# EAGLE design nRF52832_MCU (EAGLE 7.6.0)

## Sheet 1 of 2
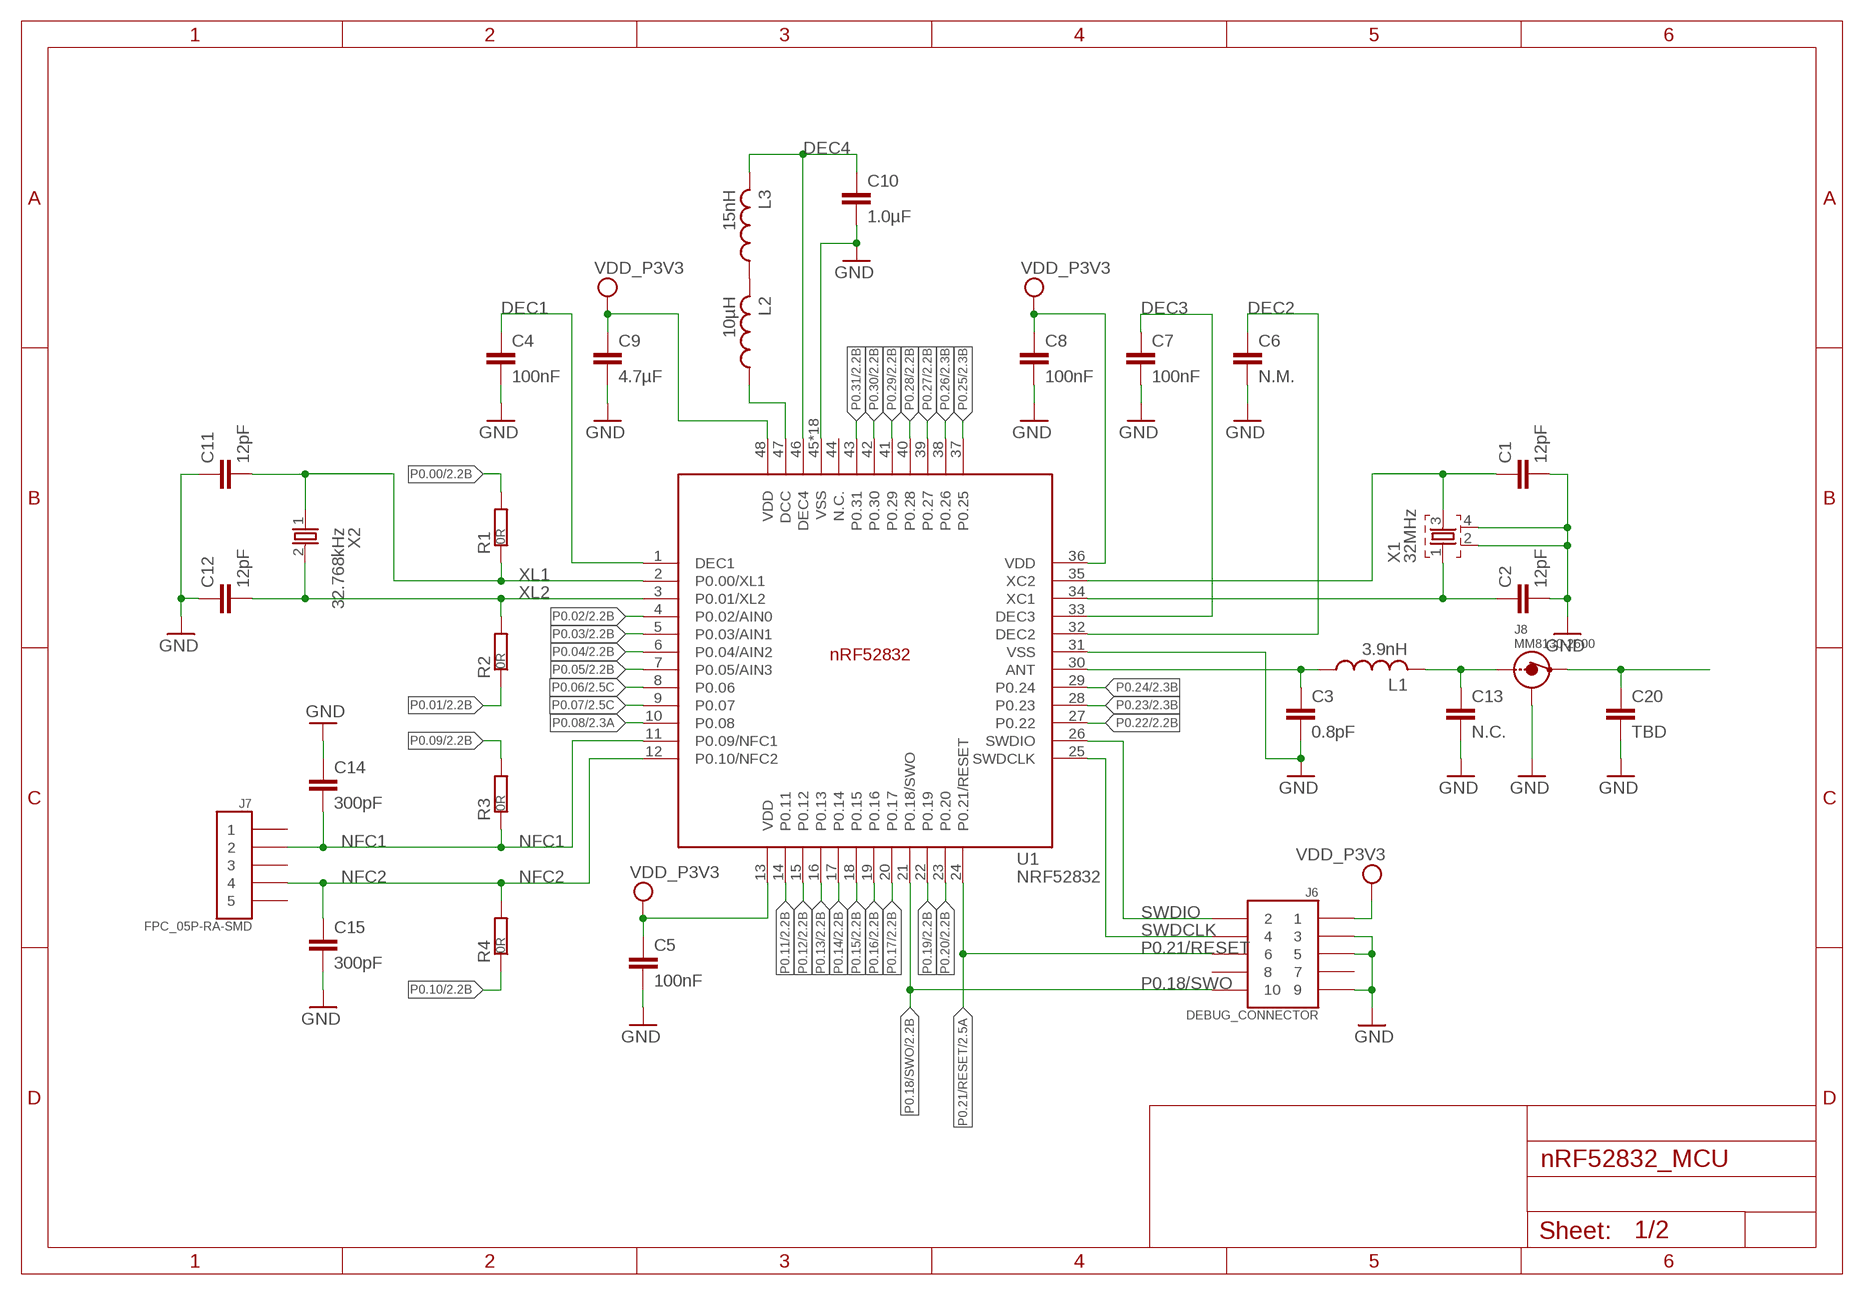
[diagram p0: schematic, sheet 1]

### Parts
C1  12pF  CAPACITOR_0402_N  [RESC0402_N]
C2  12pF  CAPACITOR_0402_N  [RESC0402_N]
C3  0.8pF  CAPACITOR_0402_N  [RESC0402_N]
C4  100nF  CAPACITOR_0402_N  [RESC0402_N]
C5  100nF  CAPACITOR_0402_N  [RESC0402_N]
C6  N.M.  CAPACITOR_0402_N  [RESC0402_N]
C7  100nF  CAPACITOR_0402_N  [RESC0402_N]
C8  100nF  CAPACITOR_0402_N  [RESC0402_N]
C9  4.7µF  CAPACITOR_0603_N  [RESC0603_N]
C10  1.0µF  CAPACITOR_0603_N  [RESC0603_N]
C11  12pF  CAPACITOR_0402_N  [RESC0402_N]
C12  12pF  CAPACITOR_0402_N  [RESC0402_N]
C13  N.C.  CAPACITOR_0402_N  [RESC0402_N]
C14  300pF  CAPACITOR_0402_N  [RESC0402_N]
C15  300pF  CAPACITOR_0402_N  [RESC0402_N]
C20  TBD  CAPACITOR_0402_N  [RESC0402_N]
J6  DEBUG_CONNECTOR  [HDRV127P5X2-10_N]
J7  FPC_05P-RA-SMD  [FPC_05P-RA-SMD]
J8  MM8130-2600  [MM8130-2600]
L1  3.9nH  INDUCTOR_0402_N  [RESC0402_N]
L2  10µH  INDUCTOR_0603_N  [RESC0603_N]
L3  15nH  INDUCTOR_0402_N  [RESC0402_N]
R1  0R  RESISTOR_0402_N  [RESC0402_N]
R2  0R  RESISTOR_0402_N  [RESC0402_N]
R3  0R  RESISTOR_0402_N  [RESC0402_N]
R4  0R  RESISTOR_0402_N  [RESC0402_N]
U1  NRF52832  [QFN40P600X600X90-48_N]
X1  32MHz  XTAL_32MHZ  [BT-XTAL_2016_N]
X2  32.768kHz  XTAL_32KHZ  [XTAL_3215_N]

### Nets
ANT: C3.1 L1.1 U1.30(ANT)
DEC1: C4.1 U1.1(DEC1)
DEC2: C6.1 U1.32(DEC2)
DEC3: C7.1 U1.33(DEC3)
DEC4: C10.1 L3.2 U1.46(DEC4)
GND: C1.2 C2.2 C3.2 C4.2 C5.2 C6.2 C7.2 C8.2 C9.2 C10.2 C11.1 C12.1 C13.2 C14.1 C15.2 C20.2 J6.3 J6.5 J6.9 J8.1 J8.2 J8.3 J8.4 U1.31(VSS) U1.45(VSS) U1.PAD(VSS) U1.PAD@VIA01(VSS) U1.PAD@VIA02(VSS) U1.PAD@VIA03(VSS) U1.PAD@VIA04(VSS) U1.PAD@VIA05(VSS) U1.PAD@VIA06(VSS) U1.PAD@VIA07(VSS) U1.PAD@VIA08(VSS) U1.PAD@VIA09(VSS) U1.PAD@VIA10(VSS) U1.PAD@VIA11(VSS) U1.PAD@VIA12(VSS) U1.PAD@VIA13(VSS) U1.PAD@VIA14(VSS) U1.PAD@VIA15(VSS) U1.PAD@VIA16(VSS) X1.2 X1.4 ; also sheet 2
N$1: C20.1 J8.OUT
N$2: L2.2 L3.1
N$3: C1.1 U1.35(XC2) X1.3
N$4: L2.1 U1.47(DCC)
N$5: C13.1 J8.IN L1.2
NFC1: C14.2 J7.2 R3.1 U1.11(P0.09/NFC1)
NFC2: C15.1 J7.4 R4.2 U1.12(P0.10/NFC2)
P0.00: R1.2 ; also sheet 2
P0.01: R2.1 ; also sheet 2
P0.02: U1.4(P0.02/AIN0) ; also sheet 2
P0.03: U1.5(P0.03/AIN1) ; also sheet 2
P0.04: U1.6(P0.04/AIN2) ; also sheet 2
P0.05: U1.7(P0.05/AIN3) ; also sheet 2
P0.06: U1.8(P0.06) ; also sheet 2
P0.07: U1.9(P0.07) ; also sheet 2
P0.08: U1.10(P0.08) ; also sheet 2
P0.09: R3.2 ; also sheet 2
P0.10: R4.1 ; also sheet 2
P0.11: U1.14(P0.11) ; also sheet 2
P0.12: U1.15(P0.12) ; also sheet 2
P0.13: U1.16(P0.13) ; also sheet 2
P0.14: U1.17(P0.14) ; also sheet 2
P0.15: U1.18(P0.15) ; also sheet 2
P0.16: U1.19(P0.16) ; also sheet 2
P0.17: U1.20(P0.17) ; also sheet 2
P0.18/SWO: J6.10 U1.21(P0.18/SWO) ; also sheet 2
P0.19: U1.22(P0.19) ; also sheet 2
P0.20: U1.23(P0.20) ; also sheet 2
P0.21/RESET: J6.6 U1.24(P0.21/RESET) ; also sheet 2
P0.22: U1.27(P0.22) ; also sheet 2
P0.23: U1.28(P0.23) ; also sheet 2
P0.24: U1.29(P0.24) ; also sheet 2
P0.25: U1.37(P0.25) ; also sheet 2
P0.26: U1.38(P0.26) ; also sheet 2
P0.27: U1.39(P0.27) ; also sheet 2
P0.28: U1.40(P0.28) ; also sheet 2
P0.29: U1.41(P0.29) ; also sheet 2
P0.30: U1.42(P0.30) ; also sheet 2
P0.31: U1.43(P0.31) ; also sheet 2
SWDCLK: J6.4 U1.25(SWDCLK)
SWDIO: J6.2 U1.26(SWDIO)
VDD_P3V3: C5.1 C8.1 C9.1 J6.1 U1.13(VDD) U1.36(VDD) U1.48(VDD) ; also sheet 2
X1: C2.1 U1.34(XC1) X1.1
XL1: C11.2 R1.1 U1.2(P0.00/XL1) X2.1
XL2: C12.2 R2.2 U1.3(P0.01/XL2) X2.2
Unconnected: J6.7 J6.8 J7.1 J7.3 J7.5 U1.44(N.C.)

## Sheet 2 of 2
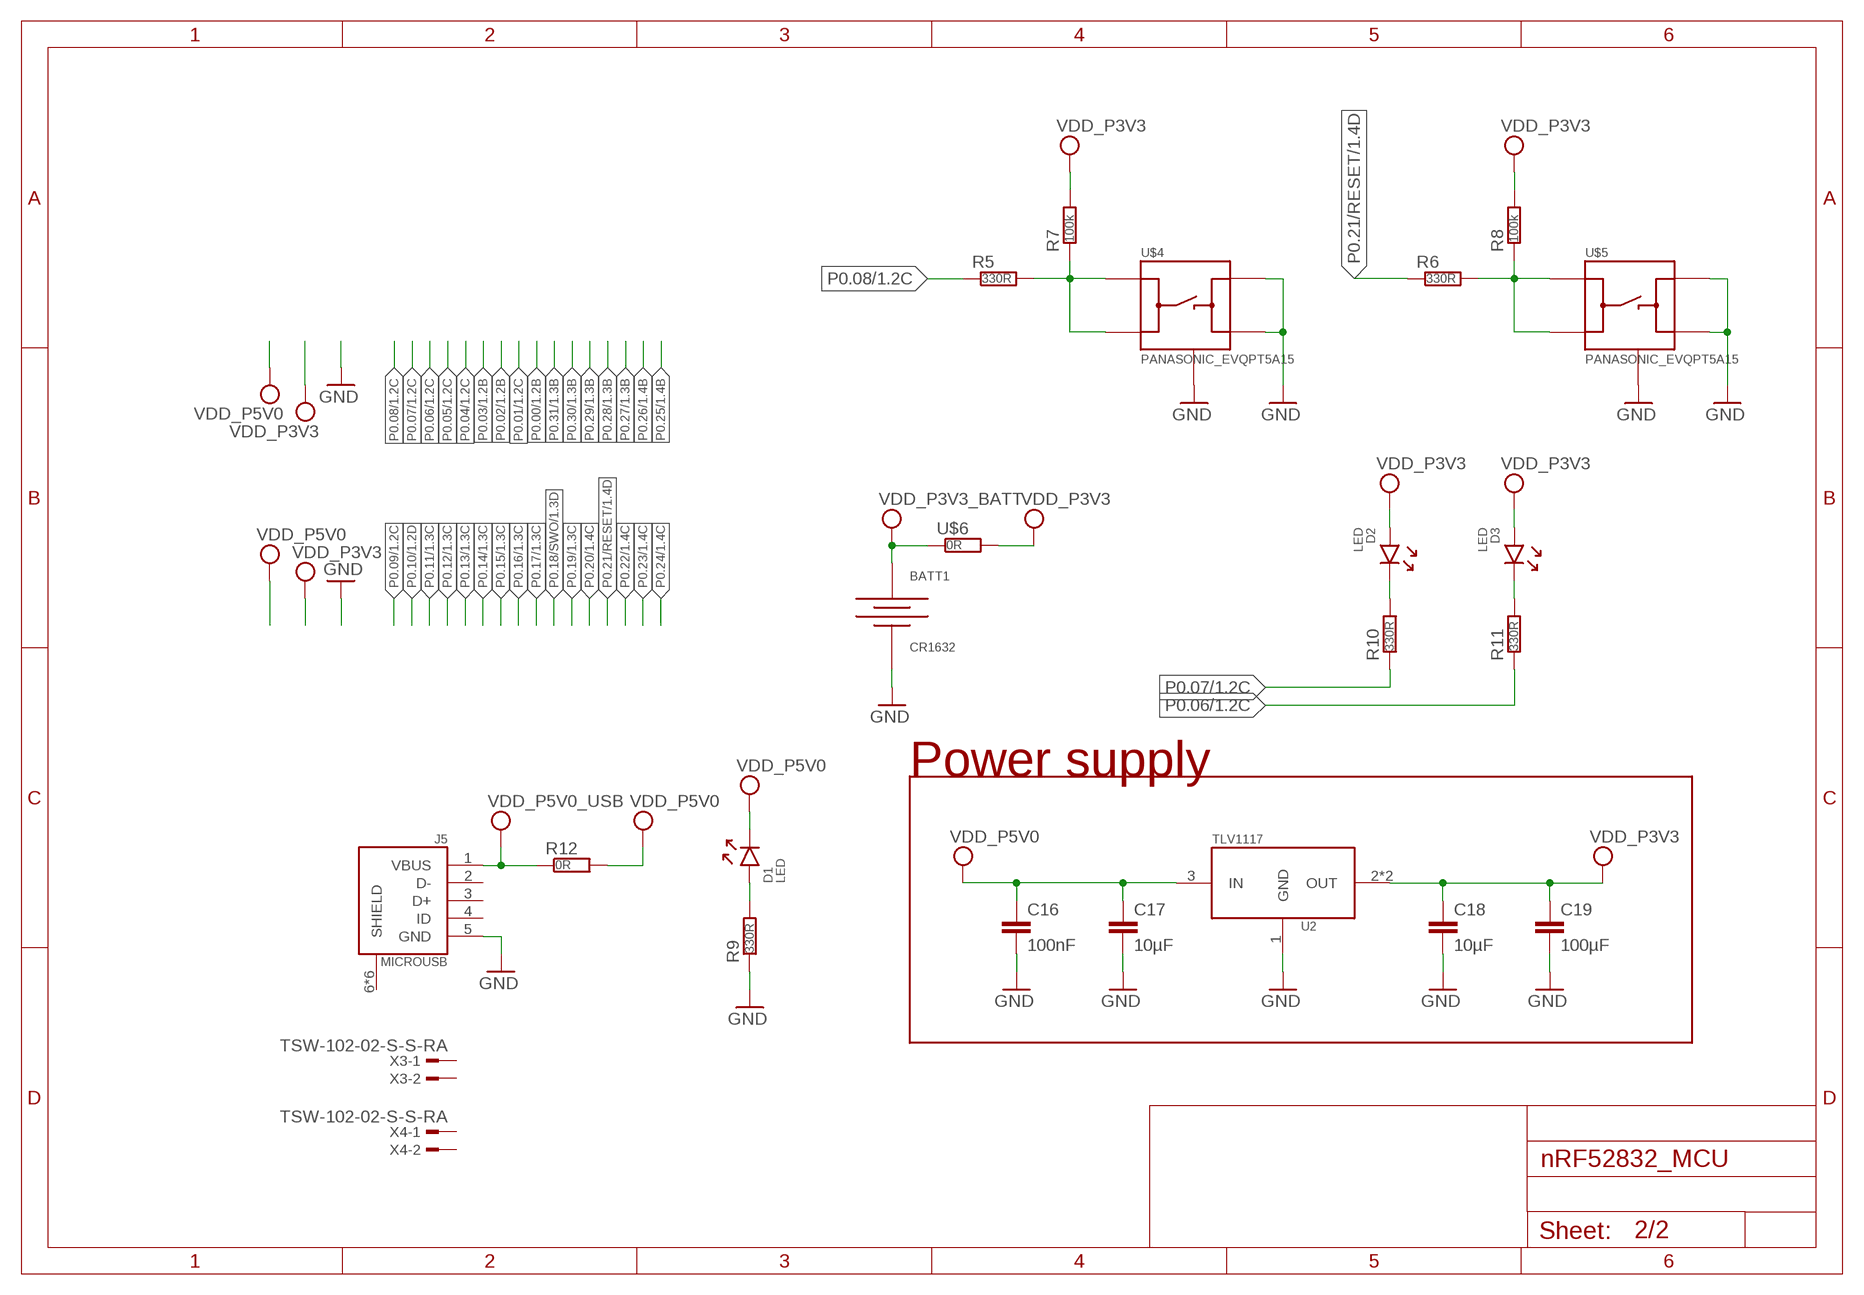
[diagram p1: schematic, sheet 2]

### Parts
BATT1  CR1632  [CR1632_HOLDER_TH]
C16  100nF  CAPACITOR_0402_N  [RESC0402_N]
C17  10µF  CAPACITOR_0603_N  [RESC0603_N]
C18  10µF  CAPACITOR_0603_N  [RESC0603_N]
C19  100µF  CAPACITOR_0805_N  [RESC0805_N]
D1  LED  [DIOC0603_N]
D2  LED  [DIOC0603_N]
D3  LED  [DIOC0603_N]
J5  MICROUSB  [USB-MICRO-B-RA-SMD-PIP]
R5  330R  RESISTOR_0402_N  [RESC0402_N]
R6  330R  RESISTOR_0402_N  [RESC0402_N]
R7  100k  RESISTOR_0402_N  [RESC0402_N]
R8  100k  RESISTOR_0402_N  [RESC0402_N]
R9  330R  RESISTOR_0402_N  [RESC0402_N]
R10  330R  RESISTOR_0402_N  [RESC0402_N]
R11  330R  RESISTOR_0402_N  [RESC0402_N]
R12  0R  RESISTOR_0402_N  [RESC0402_N]
U2  TLV1117  [SOT220P700-4_N]
U$4  PANASONIC_EVQPT5A15  [PANASONIC_EVQPT5A15]
U$5  PANASONIC_EVQPT5A15  [PANASONIC_EVQPT5A15]
U$6  0R  RESISTOR_0402_N  [RESC0402_N]
X3  TSW-102-02-S-S-RA  [TSW-102-02-S-S-RA]
X4  TSW-102-02-S-S-RA  [TSW-102-02-S-S-RA]

### Nets
GND: BATT1.1(-) C16.2 C17.2 C18.2 C19.2 J5.5(GND) R9.1 U2.1(GND) U$4.3(B) U$4.4(B') U$4.5(GND) U$4.6(GND) U$5.3(B) U$5.4(B') U$5.5(GND) U$5.6(GND) ; also sheet 1
N$6: R6.2 R8.1 U$5.1(A) U$5.2(A')
N$7: R5.2 R7.1 U$4.1(A) U$4.2(A')
N$8: D2.1(C) R10.2
N$9: D3.1(C) R11.2
P0.06: R11.1 ; also sheet 1
P0.07: R10.1 ; also sheet 1
P0.08: R5.1 ; also sheet 1
P0.21/RESET: R6.1 ; also sheet 1
VCC_P5V0_USB: J5.1(VBUS) R12.1 ; supply symbol labelled VDD_P5V0_USB
VDD_LED: D1.2(A) R9.2
VDD_P3V3: C18.1 C19.1 D2.2(A) D3.2(A) R7.2 R8.2 U2.2(OUT) U2.4(OUT) U$6.2 ; also sheet 1
VDD_P3V3_BATT: BATT1.2(+) BATT1.3(+) U$6.1
VDD_P5V0: C16.1 C17.1 D1.1(C) R12.2 U2.3(IN)
Unconnected: J5.2(D-) J5.3(D+) J5.4(ID) J5.6(SHIELD) J5.7(SHIELD) J5.8(SHIELD) J5.9(SHIELD) J5.10(SHIELD) J5.11(SHIELD) X3.1 X3.2 X4.1 X4.2

### Notes on the sheet
- Power supply

## Library data of the parts
BATT1 = Nordic_misc:CR1632: KEYSTONE 3013 BATTERY THM RETAINER, 16MM Farnell: 1650698
C1-C20 = Nordic_misc:CAPACITOR: Generic chip capacitor
D1-D3 = Nordic_misc:LED
J5 = Nordic_misc:MICROUSB
J6 = Nordic_misc:DEBUG_CONNECTOR
J7 = Nordic_misc:FPC_05P-RA-SMD
J8 = Nordic_misc:MM8130-2600
L1-L3 = Nordic_misc:INDUCTOR: Generic chip inductor
R1-R12 U$6 = Nordic_misc:RESISTOR: Generic chip resistor
U1 = Nordic_nRF:NRF52832: nRF52832 Features Single chip, highly flexible, 2.4 GHz multi-protocol SoC 32-bit ARM Cortex-M4F Processor 1.7v to 3.6v operation 512kB flash + 64kB RAM Supports concurrent Bluetooth Smart/ANT protocol operation On-chip NFC tag for Out-of-Band (OOB) pairing Up to +4dBm output power -96dBm sensitivity, Bluetooth Smart Thread safe and run-time protected Event driven API On air compatible with nRF24L and nRF24AP series 2 data rates (2Mbps/1Mbps) PPI - maximum flexibility for power-efficient applications and code simplification Automated power management system with automatic power management of each peripheral Configurable I/O mapping for analog and digital I/O 3 x Master/Slave SPI 2 x Two-wire interface (I²C) UART (RTS/CTS) 3 x PWM AES HW encryption Real Time Counter (RTC) Digital microphone interface (PDM) On-chip balun Applications Internet of Things (IoT) Wearables SmartHome sensors Connected white goods Computer peripherals Voice-command smart remotes A4WP ‘Rezence’ wireless charging Beacons Sports and fitness sensors and hubs Connected health products Smart watches RC Toys Interactive games Building automation and sensor networks
U2 = Nordic_misc:TLV1117
U$4 U$5 = Nordic_misc:PANASONIC_EVQPT5A15
X1 = Nordic_nRF:XTAL_32MHZ
X2 = Nordic_nRF:XTAL_32KHZ
X3 X4 = con-samtec:TSW-102-02-S-S: THROUGH-HOLE .025" SQ POST HEADER Source: Samtec TSW.pdf; OC_FARNELL: unknown; OC_NEWARK: unknown

## Board
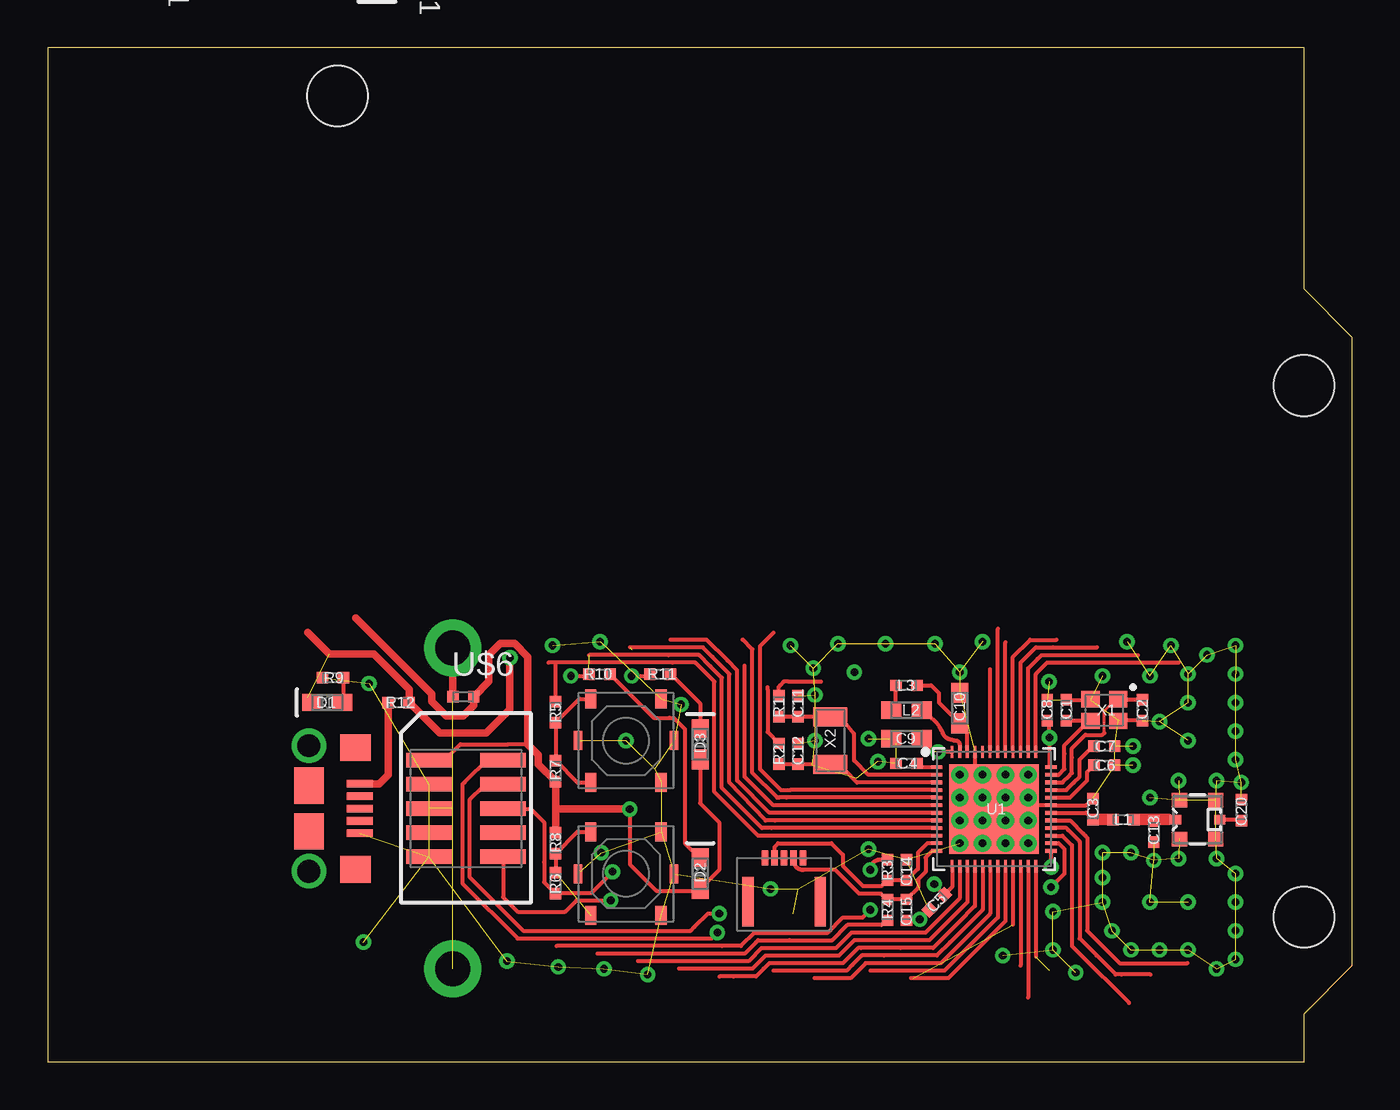
[diagram p2: board, top side]
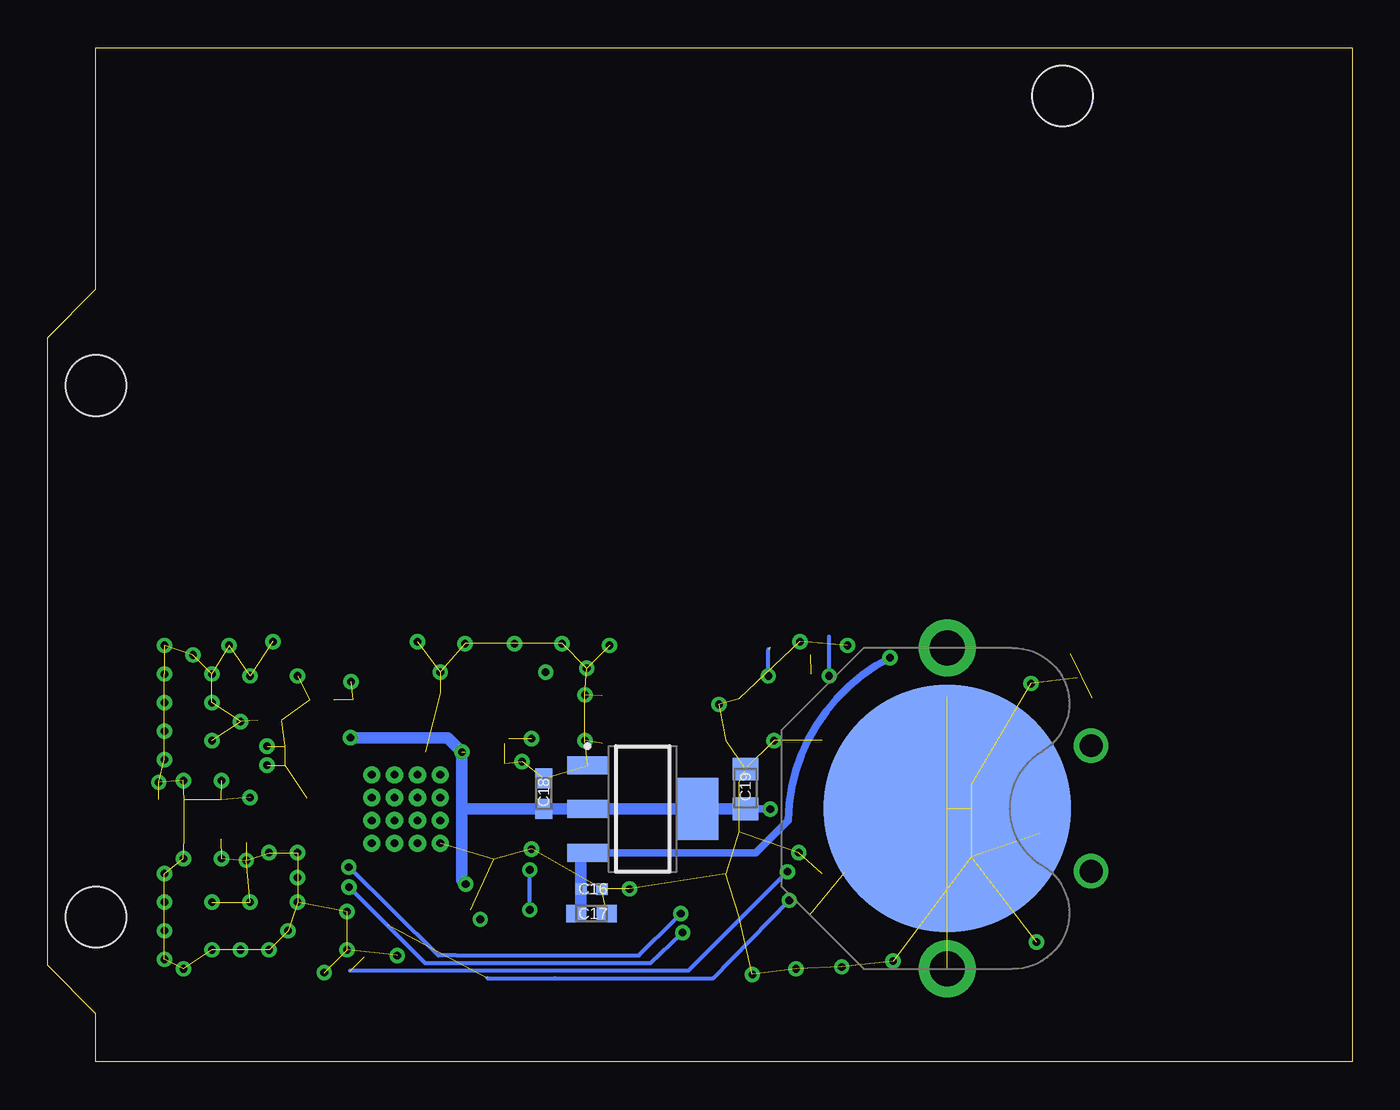
[diagram p3: board, bottom side, seen from below]

Size 68.58 x 53.34 mm. Coordinates in mm from the lower left corner, seen from the top.
Outline: 0,0 66.04,0 66.04,2.54 68.58,5.08 68.58,38.1 66.04,40.64 66.04,53.34 0,53.34 0,0
Copper layers (1*16): Top 0.035mm / dielectric 1.5mm / Bottom 0.035mm
Design rules "Nordic": minimum track width 0.15mm, minimum drill 0.4mm, track to track 0.15mm, track to pad 0.15mm, pad to pad 0.15mm, via to via 0.15mm, smd to smd 0.15mm, copper to edge 0.4mm, drill to drill 0.4mm, minimum pad ring 10mil, minimum via ring 8mil, stop-mask expansion 4mil, vias tented up to drill 0mil, thermal gap 0.2mm
Holes 3.2 mm at 66.04,7.62 66.04,35.56 15.24,50.8
tRestrict: area 53.1,11.5 to 56.7,15.3

### Footprints (pad centres in the part's own frame; a part is rotated, then mirrored left to right if it is on the bottom)
CR1632_HOLDER_TH = smd 13 x 13: 1 0,0 | drill 1.85 pad 3: 2 -8.435,0; 3 8.435,0
RESC0402_N = smd 0.6 x 0.6: 1 -0.55,0; 2 0.55,0
RESC0603_N = smd 1.05 x 0.9: 1 -0.8,0; 2 0.8,0
RESC0805_N = smd 1.2 x 1.35: 1 -1.1,0; 2 1,0
DIOC0603_N = smd 1.05 x 0.9: 1 -0.8,0; 2 0.8,0
USB-MICRO-B-RA-SMD-PIP = smd 1.35 x 0.4: 1 0,1.3; 2 0,0.65; 3 0,0; 4 0,-0.65; 5 0,-1.3 | smd 1.6 x 1.4: 6 -0.225,3.2; 7 -0.225,-3.2 | smd 1.55 x 1.9: 8 -2.675,1.2; 9 -2.675,-1.2 | drill 1.2: 10 -2.675,3.3; 11 -2.675,-3.3
HDRV127P5X2-10_N = smd 0.76 x 2.4: 1 -2.54,-1.95; 2 -2.54,1.95; 3 -1.27,-1.95; 4 -1.27,1.95; 5 0,-1.95; 6 0,1.95; 7 1.27,-1.95; 8 1.27,1.95; 9 2.54,-1.95; 10 2.54,1.95
FPC_05P-RA-SMD = smd 0.6 x 2.6: 0 -1.9,-0.7; 00 1.9,-0.7 | smd 0.35 x 0.8: 1 -1,1.6; 2 -0.5,1.6; 3 0,1.6; 4 0.5,1.6; 5 1,1.6
MM8130-2600 = smd 0.75 x 0.8: 1 -1.025,0.95; 2 1.025,0.95; 3 -1.025,-0.95; 4 1.025,-0.95 | smd 0.5 x 0.58: IN 0,1.16; OUT 0,-1.16
QFN40P600X600X90-48_N = smd 0.65 x 0.2: 1 -3,2.2; 2 -3,1.8; 3 -3,1.4; 4 -3,1; 5 -3,0.6; 6 -3,0.2; 7 -3,-0.2; 8 -3,-0.6; 9 -3,-1; 10 -3,-1.4; 11 -3,-1.8; 12 -3,-2.2; 25 3,-2.2; 26 3,-1.8; 27 3,-1.4; 28 3,-1; 29 3,-0.6; 30 3,-0.2; 31 3,0.2; 32 3,0.6; 33 3,1; 34 3,1.4; 35 3,1.8; 36 3,2.2 | smd 0.2 x 0.65: 13 -2.2,-3; 14 -1.8,-3; 15 -1.4,-3; 16 -1,-3; 17 -0.6,-3; 18 -0.2,-3; 19 0.2,-3; 20 0.6,-3; 21 1,-3; 22 1.4,-3; 23 1.8,-3; 24 2.2,-3; 37 2.2,3; 38 1.8,3; 39 1.4,3; 40 1,3; 41 0.6,3; 42 0.2,3; 43 -0.2,3; 44 -0.6,3; 45 -1,3; 46 -1.4,3; 47 -1.8,3; 48 -2.2,3 | smd 4.7 x 4.7: PAD 0,0 | drill 0.4: PAD@VIA01 -1.8,1.8; PAD@VIA02 -1.8,0.6; PAD@VIA03 -1.8,-0.6; PAD@VIA04 -1.8,-1.8; PAD@VIA05 -0.6,1.8; PAD@VIA06 -0.6,0.6; PAD@VIA07 -0.6,-0.6; PAD@VIA08 -0.6,-1.8; PAD@VIA09 0.6,1.8; PAD@VIA10 0.6,0.6; PAD@VIA11 0.6,-0.6; PAD@VIA12 0.6,-1.8; PAD@VIA13 1.8,1.8; PAD@VIA14 1.8,0.6; PAD@VIA15 1.8,-0.6; PAD@VIA16 1.8,-1.8
SOT220P700-4_N = smd 2.15 x 0.95: 1 -2.9,2.3; 2 -2.9,0; 3 -2.9,-2.3 | smd 2.15 x 3.25: 4 2.9,0
PANASONIC_EVQPT5A15 = smd 0.6 x 1: 1 -1.85,2.2; 2 -1.85,-2.2; 3 1.85,2.2; 4 1.85,-2.2 | smd 0.45 x 1: 5 -2.525,0; 6 2.525,0
BT-XTAL_2016_N = smd 0.95 x 0.85: 1 -0.725,-0.575; 2 0.725,-0.575; 3 0.725,0.575; 4 -0.725,0.575
XTAL_3215_N = smd 1 x 1.8: 1 -1.25,0; 2 1.25,0
TSW-102-02-S-S-RA = drill 1 pad 1.5 octagon: 1 1.27,1.524; 2 -1.27,1.524

### Placement (x,y rotation side)
BATT1  21.29,13.33 270 bottom
C1  53.54,18.5 90 top
C2  57.54,18.5 270 top
C3  54.94,13.3 90 top
C4  45.14,15.7 180 top
C5  46.74,8.4 225 top
C6  55.54,15.6 0 top
C7  55.54,16.6 0 top
C8  52.54,18.5 90 top
C9  45.14,17 180 top
C10  47.94,18.6 90 top
C11  39.44,18.7 270 top
C12  39.44,16.2 270 top
C13  58.14,12.1 270 top
C14  45.14,10.1 270 top
C15  45.14,8 270 top
C16  40,9.1 0 bottom
C17  40,7.8 0 bottom
C18  42.5,14.1 90 bottom
C19  31.9,14.4 90 bottom
C20  62.74,13.25 90 top
D1  14.7,18.9 0 top
D2  34.3,9.9 270 top
D3  34.3,16.7 270 top
J5  16.41,13.33 0 top
J6  21.99,13.33 270 top
J7  38.71,9.14 0 top
J8  60.44,12.75 90 top
L1  56.54,12.75 0 top
L2  45.14,18.5 180 top
L3  45.14,19.8 0 top
R1  38.44,18.7 90 top
R2  38.44,16.2 270 top
R3  44.14,10.1 90 top
R4  44.14,8 90 top
R5  26.7,18.4 270 top
R6  26.7,9.4 90 top
R7  26.7,15.3 270 top
R8  26.7,11.5 90 top
R9  15,20.2 0 top
R10  29,20.4 0 top
R11  32.2,20.4 0 top
R12  18.45,18.9 0 top
U1  49.74,13.3 0 top
U2  37.3,13.3 0 bottom
U$4  30.4,16.9 0 top
U$5  30.4,9.9 0 top
U$6  21.85,19.2 0 top
X1  55.54,18.5 180 top
X2  41.14,16.9 270 top
X3  18.38,58.42 270 top  (outside the outline)
X4  5.18,58.84 270 top  (outside the outline)

### Tracks (layer width: path | path; a pad name or v marks a point on that pad's centre or on a via)
ANT
  Top 0.2: U1.30 54.59,13.1 C3.1 54.99,12.75
  Top 0.6: L1.1 54.99,12.75
DEC1
  Top 0.2: U1.1 45.89,15.5 C4.1
DEC2
  Top 0.2: U1.32 53.74,13.9 54.34,14.5 54.64,14.8 54.64,15 54.64,15.25 C6.1
DEC3
  Top 0.2: U1.33 53.54,14.3 53.94,14.7 54.24,15 54.24,15.9 54.89,16.55 C7.1
DEC4
  Top 0.2: U1.46 48.34,17.3 C10.1 46.84,18.9 46.84,19.4 46.44,19.8 L3.2
GND  (via drill 0.4, 0.4 pad 0.8)  (104 unrouted)
  Top 0.2: 51.59,13.49 U1.31 54.59,13.5 C3.2 | 51.59,13.49 arc-90 U1.PAD@VIA14 | 48.79,15.29 arc90 U1.PAD@VIA05 | U1.PAD@VIA01 48.74,15.1 | 48.74,15.1 U1.PAD@VIA05 | U1.PAD@VIA05 U1.PAD@VIA09 U1.PAD@VIA13 U1.PAD@VIA14 | U1.PAD@VIA02 U1.PAD@VIA06 | U1.PAD@VIA06 U1.PAD@VIA10 U1.PAD@VIA14 | 51.59,13.49 51.59,13.09 arc-90 U1.PAD@VIA15 | U1.PAD@VIA15 U1.PAD@VIA16 U1.PAD@VIA12 | U1.PAD@VIA15 U1.PAD@VIA11 U1.PAD@VIA07 U1.PAD@VIA03 U1.PAD@VIA04 U1.PAD@VIA08 | U1.PAD@VIA06 arc90 U1.PAD | U1.45 48.74,15.1 | C2.2 56.29,17.95 X1.4 | C1.2 54.79,19.05 X1.2 | 44.59,16.75 C9.2 | C5.2 v45.84,7.5 45.79,7.45 C15.2
  other vias: 40.34,16.9 40.34,19.3 47.94,20.5 43.14,17 52.64,20 57.04,16.6 57.04,15.6 58.14,10.6 59.44,10.7 61.44,10.7 61.44,14.8 59.44,14.8 62.74,14.7 55.44,11 55.44,9.7 55.44,8.4 55.94,6.9 56.94,5.9 58.44,5.9 59.94,5.9 61.44,4.9 62.44,5.4 62.44,6.9 62.44,8.4 62.44,9.9 57.94,8.4 59.94,8.4 56.94,11 57.94,13.9 62.44,15.9 62.44,17.4 62.44,18.9 62.44,20.4 62.44,21.9 60.94,21.4 59.94,20.4 57.94,20.3 55.44,20.3 59.94,18.9 59.94,16.9 43.14,11.2 58.44,17.9 52.84,7.9 52.84,5.9 54.04,4.7 26.84,5 29.24,4.9 31.54,4.6 26.54,21.9 29.04,22.1 39.04,21.9 40.24,20.7 41.54,22 44.04,22 46.64,22 49.14,22.1 59.04,21.9 56.74,22.1 24.14,5.3 43.64,15.8 50.2,5.6 38,9.1 30.4,16.9 29.1,11 16.6,6.3 16.9,19.9 33.3,18.8
N$1
  Top 0.2: J8.OUT 62.74,12.75 | 62.74,12.75 C20.1 62.74,12.75
N$2
  Top 0.2: L2.2 44.59,18.5 L3.1
N$3
  Top 0.2: U1.35 53.14,15.1 53.44,15.4 53.44,16.2 53.44,16.65 54.74,17.95 | C1.1 54.74,17.95 | 54.74,17.95 54.79,17.95 X1.3
N$4
  Top 0.2: L2.1 46.44,18.1 arc-29 47.04,17.3 arc45 47.34,17 arc17 47.74,16.9 arc-79 47.94,16.7 U1.47
N$5
  Top 0.2: C13.1 58.14,12.75 | 58.89,12.75 J8.IN
  Top 0.6: L1.2 58.14,12.75 58.89,12.75
N$6  (1 unrouted)
  Top 0.2: U$5.1 27.85,12.1 R8.1 R6.2
N$7
  Top 0.2: U$4.2 27.85,14.7 R7.1 R5.2 27.95,19.1 U$4.1
N$8
  Top 0.2: R10.2 31.85,18.1 32.7,18.1 32.9,18.1 33.5,17.5 33.5,17 33.5,11.5 D2.1
N$9
  Top 0.2: R11.2 34.3,18.85 D3.1
N$15  (via drill 0.4)
  other vias: 42.4,20.5
NFC1
  Top 0.2: U1.11 46.24,11.5 45.74,11 45.74,10.15 C14.2 R3.1 43.84,9.25 42.85,9.25 42.6,9.5 41.8,10.3 41.8,10.9 41.2,11.5 38.4,11.5 38.21,11.31 J7.2
NFC2
  Top 0.2: U1.12 46.5,11.1 46.15,10.75 46.15,10 45.75,9.6 45.75,9.16 C15.1 R4.2 43.79,8.85 42.75,8.85 42.65,8.85 41.4,10.1 39.7,10.1 arc-90 39.21,10.59 J7.4
P0.00
  Top 0.2: 40.66,20 38.94,20 38.7,20 38.5,19.8 38.44,19.74 R1.2
P0.01
  Top 0.2: R2.1 37.84,17.35 37.84,19.6 37.84,19.72
P0.02
  Top 0.2: U1.4 39.04,14.3 38.54,14.3 37.44,15.4 37.44,21.86 38.14,22.56
P0.03
  Top 0.2: U1.5 38.84,13.9 38.44,13.9 38.34,13.9 37.04,15.2 37.04,21.7 36.53,22.21
P0.04
  Top 0.2: U1.6 38.64,13.5 38.14,13.5 36.64,15 36.64,20.84
P0.05
  Top 0.2: U1.7 38.44,13.1 37.94,13.1 36.24,14.8 36.24,20.6 35.74,21.1 34.64,22.2 33.44,22.2 32.74,22.2
P0.06  (via drill 0.4)  (1 unrouted)
  Top 0.2: U1.8 38.24,12.7 37.74,12.7 35.84,14.7 35.84,20.4 34.94,21.3 34.44,21.8 32.54,21.8 30.6,21.8 | v30.7,20.3 31.55,20.3 arc90 R11.1
  Bottom 0.2: v30.7,20.3 30.7,21.7
P0.07  (via drill 0.4)  (1 unrouted)
  Top 0.2: U1.9 38.04,12.3 37.54,12.3 35.44,14.4 35.44,20.2 34.84,20.8 34.24,21.4 32.64,21.4 28.46,21.4 | v27.5,20.3 28.35,20.3 arc90 R10.1
  Bottom 0.2: v27.5,20.3 27.5,22.36
P0.08
  Top 0.2: U1.10 37.84,11.9 37.34,11.9 35.04,14.2 35.04,20 34.74,20.3 34.04,21 32.84,21 26.7,21 | 26.7,21 26.32,21 | R5.1 26.7,21
P0.09  (via drill 0.4 pad 0.8)
  Top 0.2: v43.24,8 42.84,7.6 41.84,7.6 41.8,7.6 41,6.8 37.14,6.8 36.44,6.1 35.44,6.1 26.76,6.1 | v43.24,10.1 arc-90 43.79,10.65 R3.2
  Bottom 0.2: v43.24,8 v43.24,10.1
P0.10
  Top 0.2: R4.1 44.09,7.45 43.84,7.2 42.04,7.2 41.24,6.4 39,6.4 37.34,6.4 37.24,6.3 36.64,5.7 35.64,5.7 28.9,5.7
P0.11
  Top 0.2: U1.14 47.94,8.6 46.74,7.4 46.14,6.8 42.24,6.8 41.44,6 37.54,6 36.84,5.3 35.84,5.3 31.04,5.3
P0.12
  Top 0.2: U1.15 48.34,8.4 46.94,7 46.34,6.4 42.4,6.4 41.6,5.6 37.74,5.6 37.04,4.9 35.84,4.9 33.18,4.9
P0.13
  Top 0.2: U1.16 48.74,8.2 47.84,7.3 46.54,6 44.84,6 42.74,6 42.6,6 41.8,5.2 37.94,5.2 37.64,4.9 37.24,4.5 36.04,4.5 35.32,4.5
P0.14
  Top 0.2: U1.17 49.14,8 47.44,6.3 46.74,5.6 43.96,5.6 42.8,5.6 42.3,5.1 42,4.8 40.8,4.8 38.16,4.8
P0.15
  Top 0.2: U1.18 49.54,7.8 46.94,5.2 44.1,5.2 43,5.2 42.2,4.4 40.3,4.4
P0.16
  Top 0.2: U1.19 49.94,7.6 48.34,6 47.14,4.8 43.24,4.8
P0.17
  Top 0.2: U1.20 50.34,7.4 47.74,4.8 47.34,4.4 46.04,4.4 45.38,4.4
P0.18/SWO  (via drill 0.4)  (1 unrouted)
  Top 0.2: U1.21 50.74,7.22 | J6.10 23.94,8.66 24.7,7.9 27.2,7.9 27.8,8.5 v29.6,8.5
  Bottom 0.2: 45.46,4.4 41.9,4.4 33.6,4.4 v29.6,8.5
P0.19
  Top 0.2: U1.22 51.14,5.08
P0.20
  Top 0.2: U1.23 51.54,3.4
P0.21/RESET  (via drill 0.4)  (1 unrouted)
  Top 0.2: U1.24 51.94,5.54 | J6.6 23.97,13.3 25,13.3 25.4,13.3 26.1,12.6 26.1,10.5 26.1,9.45 R6.1 26.7,8.9 26.8,8.9 28.6,8.9 v29.7,10
  Bottom 0.2: v29.7,10 34.9,4.8 41,4.8 49.6,4.8 52.68,4.8
P0.22
  Top 0.2: U1.27 53.34,11.9 53.84,11.4 53.84,6.1 54.14,5.8 56.84,3.1
P0.23
  Top 0.2: 57.96,4.6 56.44,4.6 56.14,4.6 55.14,5.6 54.54,6.2 54.24,6.5 54.24,11.6 53.64,12.2 53.54,12.3 U1.28
P0.24
  Top 0.2: U1.29 53.74,12.7 54.44,12 54.54,11.9 54.64,11.8 54.64,6.9 54.94,6.6 56.34,5.2 59.9,5.2
P0.25
  Top 0.2: U1.37 51.94,20.4 52.54,21 59.44,21
P0.26
  Top 0.2: U1.38 51.54,20.7 52.04,21.2 52.24,21.4 53.64,21.4 57.3,21.4
P0.27
  Top 0.2: U1.39 51.14,21 51.94,21.8 52.84,21.8 55.16,21.8
P0.28
  Top 0.2: U1.40 50.74,21.3 51.64,22.2 53.02,22.2
P0.29
  Top 0.2: U1.41 50.34,22.06
P0.30
  Top 0.2: U1.42 49.94,22.78
P0.31
  Top 0.2: U1.43 49.54,20.64
SWDCLK  (via drill 0.4)
  Top 0.2: J6.4 23.84,14.5 22.9,14.5 22.2,13.8 22.2,9.7 25,6.9 33.8,6.9 34,7.1 34.7,7.8 v35.3,7.8 | v52.75,10.25 v52.74,10.26 U1.25
  Bottom 0.2: v35.3,7.8 35.6,7.5 37.5,5.6 47.1,5.6 48.04,5.6 v52.75,10.25
SWDIO  (via drill 0.4, 0.4 pad 0.8)
  Top 0.2: U1.26 53.14,11.5 53.34,11.3 53.44,11.2 53.44,9.9 v52.74,9.2 | J6.2 23.07,15.87 22,14.8 21.9,14.7 21.8,14.6 21.8,9.4 24.7,6.5 34.7,6.5 34.9,6.5 v35.2,6.8
  Bottom 0.2: v35.2,6.8 35.3,6.7 36.9,5.2 48.04,5.2 48.74,5.2 v52.74,9.2
VCC_P5V0_USB
  Top 0.4: J5.1 17.43,14.63 17.9,15.1 R12.1
VDD_LED
  Top 0.2: R9.2 15.55,19.15 D1.2
VDD_P3V3  (via drill 0.4, 0.4 pad 0.8)  (1 unrouted)
  Top 0.2: U1.13 47.54,9.2 C5.1 46.6,9.32 v46.6,9.35 | U1.48 46.64,16.3 C9.1 | U1.36 52.65,15.59 v52.65,17.05 52.65,17.84 C8.1 | D3.2 34.3,13.6 35.3,12.6 35.3,10.1 D2.2 34.2,9 32,9 30.6,10.4 v30.6,13.3 | R8.2 26.7,13.3 | J6.1 20.11,15.8 20.8,15.8 21.7,16.7 24.2,16.7 25.25,16.7
  Top 0.4: R8.2 R7.2 25.8,15.65 25.8,16.15 25.25,16.7 25.25,21.3 24.55,22 23.8,22 23.2,21.4 23.2,20 U$6.2 22.4,18.75 21.85,18.2 20.95,18.2 20.2,18.95 20.2,19.35 19.15,20.4 16.21,23.34 | 26.7,13.3 v30.6,13.3
  Bottom 0.4: v30.6,13.3 C19.1
  Bottom 0.6: v52.65,17.05 47.55,17.05 v46.8,16.3 | v46.8,16.3 46.8,13.2 | 46.8,13.2 46.8,9.55 v46.6,9.35 | v46.8,16.3 46.8,13.3 | C18.1 U2.2 U2.4 C19.1 | C18.1 42.5,13.2 C18.1 | C18.1 46.7,13.3 46.8,13.2
VDD_P3V3_BATT  (1 unrouted)
  Top 0.4: U$6.1 21.3,21.75 BATT1.2
VDD_P5V0  (via drill 0.4)  (1 unrouted)
  Top 0.2: D1.1 13.67,19.13
  Top 0.4: v24.3,21.25 24.3,18.55 23.05,17.3 21.3,17.3 20.6,17.3 R12.2 19,19.6 18.15,20.45 17.15,21.45 14.8,21.45 13.67,22.58
  Bottom 0.4: U2.3 31.55,11 31.35,11 29.65,12.7 arc62 v24.3,21.25
  Bottom 0.6: U2.3 arc-90 40.55,10.65 C16.1 40.55,8.05 arc90 C17.1
X1
  Top 0.15: 55.54,17.3 55.54,18.45 56.16,19.07 X1.1
  Top 0.2: C2.1 56.29,19.05 X1.1 | U1.34 53.34,14.7 53.74,15.1 53.84,15.2 53.84,16 53.84,16.5 54.54,17.2 55.44,17.2 55.54,17.3
XL1
  Top 0.2: 41.24,18.15 41.69,18.15 42.39,17.25 42.39,15.85 43.14,15.1 U1.2 | 41.24,18.15 X2.1 C11.2 R1.1 | 41.64,18.1 41.54,18 41.24,18 41.24,18.15
XL2
  Top 0.2: 41.34,15.6 41.19,15.6 X2.2 C12.2 R2.2 | 41.34,15.6 41.64,15.6 | 41.34,15.6 41.44,15.5 41.64,15.3 41.94,15.3 42.54,14.7 U1.3